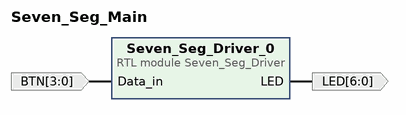
[diagram p0: block diagram of the top level]
# Vivado block design Seven_Seg_Main, xc7z020clg400-1, Vivado 2021.1
create_bd_design Seven_Seg_Main

create_bd_port -dir O -from 6 -to 0 LED
create_bd_port -dir I -from 3 -to 0 BTN

create_bd_cell -type module -reference Seven_Seg_Driver Seven_Seg_Driver_0

# ---- connections ----

connect_bd_net [get_bd_ports BTN] [get_bd_pins Seven_Seg_Driver_0/Data_in]
connect_bd_net [get_bd_pins Seven_Seg_Driver_0/LED] [get_bd_ports LED]

validate_bd_design
save_bd_design
